# EAGLE design Wii (EAGLE 6.2)
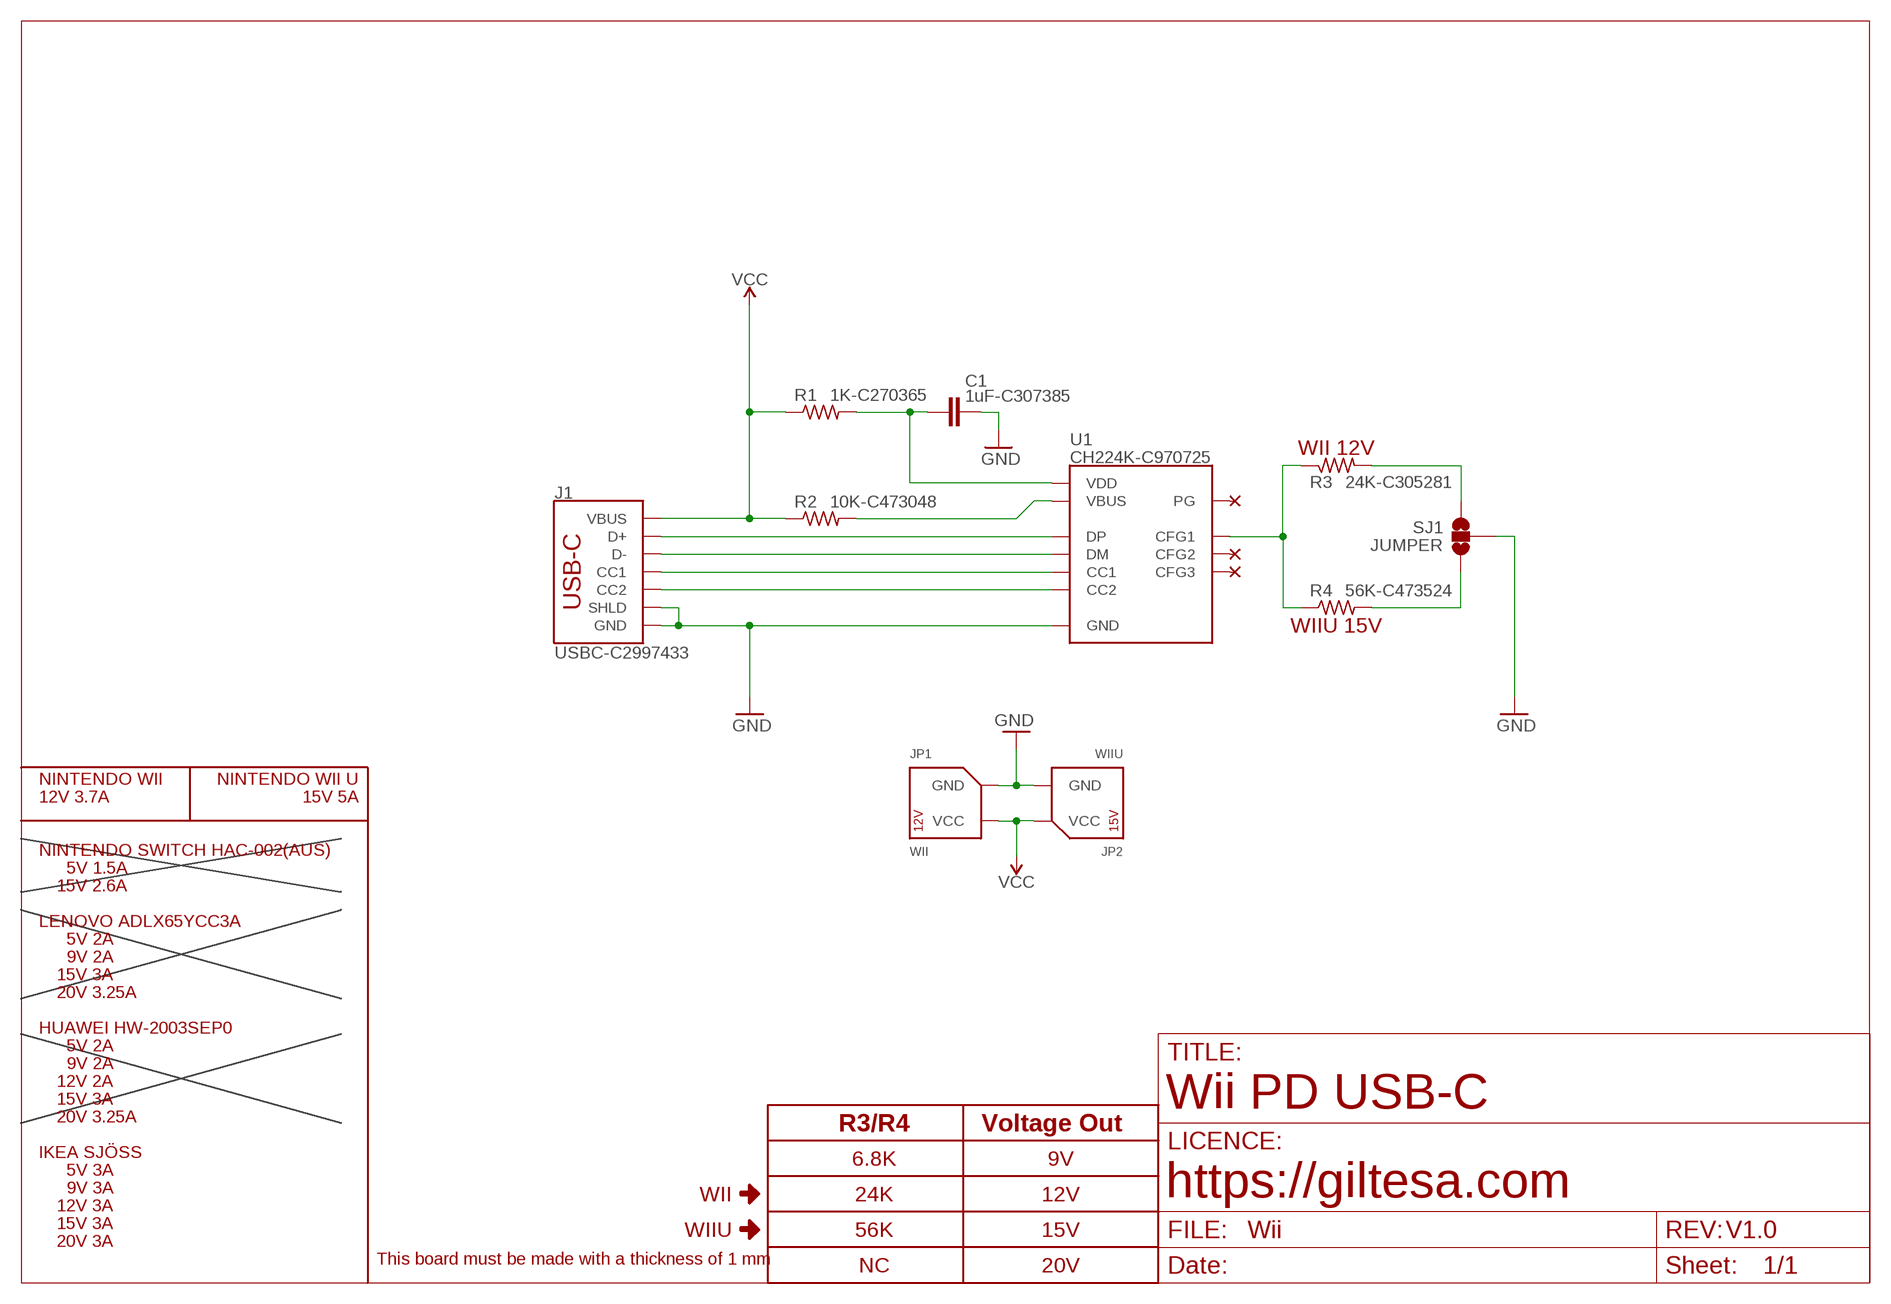
[diagram p0: schematic, sheet 1]

## Parts
C1  1uF-C307385  C0201  [C0201]
J1  USBC-C2997433  USB-C_16P_DATA  [USB-C_16P]
JP1  WII  WII_PWD_CONNECTOR  [WII_1X02]
JP2  WIIU  WII_U_PWD_CONNECTOR  [WIIU_1X02]
R1  1K-C270365  R0201  [R0201]
R2  10K-C473048  R0201  [R0201]
R3  24K-C305281  R0201  [R0201]
R4  56K-C473524  R0201  [R0201]
SJ1  JUMPER  JUMPER-SMD-3_NO  [JUMPER-SMD-3_NO_SILK]
U1  CH224K-C970725  CH224K  [ESSOP10]

## Nets
CC1: J1.A5-CC1(CC1) U1.7(CC1)
CC2: J1.B5-CC2(CC2) U1.6(CC2)
D+: J1.A6-DP1(D+) J1.B6-DP2(D+) U1.4(DP)
D-: J1.A7-DN1(D-) J1.B7-DN2(D-) U1.5(DM)
GND: C1.2 J1.GND1(GND) J1.GND2(GND) J1.SHLD1(SHLD) J1.SHLD2(SHLD) J1.SHLD3(SHLD) J1.SHLD4(SHLD) JP1.GND1(GND) JP2.GND1(GND) SJ1.2 U1.0(GND)
N$1: R3.2 SJ1.1
N$2: R3.1 R4.1 U1.9(CFG1)
N$3: R4.2 SJ1.3
N$6: R2.2 U1.8(VBUS)
VCC: J1.VBUS1(VBUS) J1.VBUS2(VBUS) JP1.VCC1(VCC) JP2.VCC1(VCC) R1.1 R2.1
VDD: C1.1 R1.2 U1.1(VDD)
Unconnected: U1.2(CFG2) U1.3(CFG3) U1.10(PG)

## Notes on the sheet
- WII 12V
- WIIU 15V
- NINTENDO WII | NINTENDO WII U
- 12V 3.7A | 15V 5A
- NINTENDO SWITCH HAC-002(AUS)
- 5V 1.5A
- 15V 2.6A
- LENOVO ADLX65YCC3A
- 5V 2A
- 9V 2A
- 15V 3A
- 20V 3.25A
- HUAWEI HW-2003SEP0
- 5V 2A
- 9V 2A
- 12V 2A
- 15V 3A | Wii PD USB-C
- 20V 3.25A | R3/R4 | Voltage Out
- IKEA SJÖSS | 6.8K | 9V
- 5V 3A
- 9V 3A | WII | 24K | 12V | https://giltesa.com
- 12V 3A
- 15V 3A | WIIU | 56K | 15V
- V1.0
- 20V 3A
- This board must be made with a thickness of 1 mm | NC | 20V

## Library data of the parts
C1 = ,giltesa:C0201
J1 = ,giltesa:USB-C_16P
JP1 = ,giltesa:WII_PWD_CONNECTOR
JP2 = ,giltesa:WII_U_PWD_CONNECTOR
R1-R4 = ,giltesa:R0201
SJ1 = ,giltesa:JUMPER-SMD-3_NO
U1 = ,giltesa:CH224K

## Net classes
1 power: width 0.61 mm, drill 0.406 mm, clearance 0.203 mm
2 gnd: width 0.305 mm, drill 0.406 mm, clearance 0.203 mm
3 power usb: width 0.508 mm, drill 0.406 mm, clearance 0.203 mm

## Board
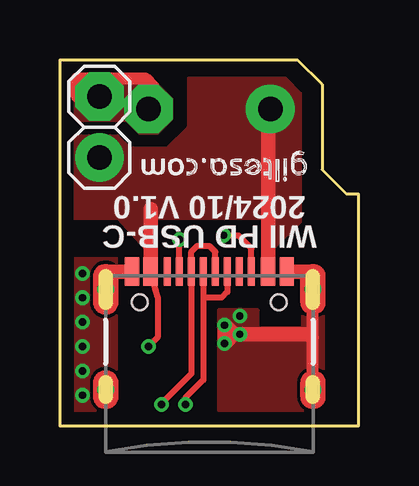
[diagram p1: board, top side]
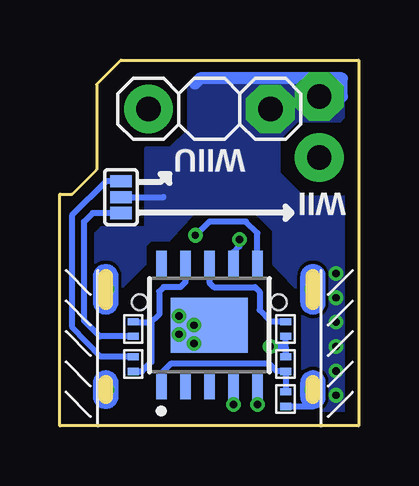
[diagram p2: board, bottom side, seen from below]

Size 12.45 x 15.24 mm. Coordinates in mm from the lower left corner, seen from the top.
Outline: 0,0 12.45,0 12.45,9.65 11.94,9.65 10.92,10.67 10.92,14.22 9.91,15.24 0,15.24 0,0
Copper layers (1*16): Top 0.035mm / dielectric 1.6mm / Bottom 0.035mm
Design rules: minimum track width 6mil, minimum drill 12mil, track to track 6mil, track to pad 6mil, pad to pad 6mil, via to via 8mil, smd to smd 0mil, copper to edge 20mil, drill to drill 10mil, minimum pad ring 6mil, minimum via ring 6mil, stop-mask expansion 0mil, vias tented up to drill 100mil, thermal gap 10mil
tKeepout: 2 lines
bKeepout: 2 lines

### Footprints (pad centres in the part's own frame; a part is rotated, then mirrored left to right if it is on the bottom)
C0201 = smd 0.305 x 0.457: 1 -0.305,0; 2 0.305,0
USB-C_16P = smd 0.3 x 1.2: A5-CC1 -1.25,2.58; A6-DP1 -0.25,2.58; A7-DN1 0.25,2.58; A8-SBU1 1.25,2.58; B5-CC2 1.75,2.58; B6-DP2 0.75,2.58; B7-DN2 -0.75,2.58; B8-SBU2 -1.75,2.58 | smd 0.6 x 1.2: GND1 -3.225,2.58; GND2 3.225,2.58; VBUS1 -2.45,2.58; VBUS2 2.45,2.58 | drill 0.4 pad 0.6: SHLD1 -4.318,1.84; SHLD2 4.318,1.84; SHLD3 -4.318,-2.34; SHLD4 4.318,-2.34 | hole 0.65: -2.89,1.31; 2.89,1.31
WII_1X02 = drill 1.016 pad 2.032 octagon: GND1 1.27,0 | drill 1.016 pad 2.032: VCC1 -1.27,0
WIIU_1X02 = drill 1.016 pad 2.032 octagon: GND1 -2.54,0 | drill 1.016 pad 2.032: VCC1 2.54,0
R0201 = smd 0.305 x 0.457: 1 -0.305,0; 2 0.305,0
JUMPER-SMD-3_NO_SILK = smd 0.508 x 0.889: 1 -0.66,0; 2 0,0; 3 0.66,0
ESSOP10 = smd 3.2 x 2.3: 0 0,0 | smd 0.43 x 1.05: 1 -2,-2.566; 2 -1,-2.566; 3 0,-2.566; 4 1,-2.566; 5 2,-2.566; 6 2,2.566; 7 1,2.566; 8 0,2.566; 9 -1,2.566; 10 -2,2.566

### Placement (x,y rotation side)
C1  3.05,1.11 270 bottom
J1  6.22,3.85 0 top
JP1  1.64,12.45 90 top
JP2  6.22,13.2 180 bottom
R1  3.05,2.57 270 bottom
R2  3.05,4.03 90 bottom
R3  9.4,4.03 270 bottom
R4  9.4,2.57 90 bottom
SJ1  9.91,9.53 90 bottom
U1  6.22,4.19 0 bottom
U$28  [GILTESA.COM_7MM_MASK]  6.85,10.8 180 top

### Tracks (layer width: path | path; a pad name or v marks a point on that pad's centre or on a via)
CC1  (via drill 0.3)
  Top 0.254: J1.A5-CC1 v4.97,7.76
  Bottom 0.254: v4.97,7.76 4.97,7.47 5.21,7.24 5.21,6.77 U1.7
CC2  (via drill 0.3)
  Top 0.254: J1.B5-CC2 7.97,7.39 7.43,7.94 v6.81,7.94
  Bottom 0.254: U1.6 4.22,8.03 4.7,8.51 6.22,8.51 v6.79,7.94 v6.81,7.94
D+  (via drill 0.3)
  Top 0.254: v5.22,0.89 5.22,1.16 5.97,1.91 5.97,5.33 | J1.A6-DP1 5.97,5.33 | J1.B6-DP2 6.97,5.58 6.73,5.33 5.97,5.33
  Bottom 0.254: 5.21,2.02 U1.4 v5.22,0.89
D-  (via drill 0.3)
  Top 0.254: v4.22,0.89 4.22,0.92 5.47,2.17 J1.B7-DN2 5.47,7.25 5.71,7.49 6.22,7.49 6.47,7.24 J1.A7-DN1
  Bottom 0.254: U1.5 v4.22,0.89
GND  (via drill 0.3)
  Top 0.508: 10.54,6.43 J1.SHLD2 10.54,3.68 | 1.91,6.43 J1.SHLD1 | J1.SHLD4 10.54,3.68 | 7.24,3.81 arc-90 v6.86,4.19 | 10.41,3.81 10.54,3.68 | 0.7,13.72 0.7,14.48 3.54,14.48 3.89,14.13
  Top 0.61: J1.GND2 10.54,6.43 | J1.GND1 1.91,6.43 | 7.24,3.81 v6.86,3.43 v6.86,4.19 7.24,3.81 | 7.24,3.81 v7.49,3.81 10.41,3.81
  Bottom 0.254: C1.2 1.91,0.81 J1.SHLD3 | SJ1.2 8.13,9.53
  Bottom 0.508: 6.04,3.43 U1.0 | 0.7,13.72 0.7,14.48 6.6,14.48 6.82,14.26
  Bottom 0.61: U1.0 v6.86,4.19
  other vias: 0.94,1.27 0.94,2.29 0.94,3.3 0.94,4.32 0.94,5.33 0.94,6.35 7.49,4.57
  pour Bottom (no thermals): 2.35,0.64 0.51,0.64 0.51,9.53 2.29,9.53 3.3,10.54 3.3,11.94 2.54,12.7 0.76,12.7 0.38,13.08 0.38,14.35 0.76,14.73 6.6,14.73 7.11,14.22 7.11,12.32 7.87,11.56 8.89,11.56 8.89,8.26 10.73,8.26 10.99,8 10.99,5.21 10.16,4.95 10.16,5.46 8.89,6.73 8.89,7.49 8.64,7.75 7.87,7.75 6.67,9.08 4.51,9.08 3.56,8.13 3.56,6.73 2.35,5.46
  pour Top (no thermals): 2.35,0.64 0.51,0.64 0.51,6.99 2.35,6.99
  pour Top (no thermals): 6.6,4.83 6.6,0.64 10.99,0.64 10.99,6.99 10.1,6.99 10.1,4.06 8.25,4.06 8.25,4.83
  pour Top (no thermals): 0.38,14.35 0.38,13.21 0.86,12.73 2.77,12.73 3.28,12.22 4.09,12.22 4.67,12.8 4.67,13.61 3.68,14.61 0.63,14.61
N$1
  Bottom 0.254: SJ1.1 11.09,8.87 11.44,8.51 11.44,4.38 10.79,3.73 R3.2
N$2
  Bottom 0.254: 7.22,6.37 U1.9 7.22,5.99 7.43,5.78 8.13,5.78 8.32,5.59 8.32,4.64 8.64,4.32 | 8.64,4.32 8.64,2.67 9.04,2.27 R4.1 | R3.1 9.38,4.32 8.64,4.32
N$3
  Bottom 0.254: SJ1.3 10.53,10.19 11.95,8.76 11.95,4.13 10.75,2.88 R4.2
N$6
  Bottom 0.254: R2.2 3.64,4.34 4.13,4.83 4.13,5.59 4.32,5.78 6.03,5.78 6.22,5.97 U1.8
VCC  (via drill 0.3)
  Top 0.254: J1.VBUS1 3.81,6.39 3.81,6.3 4.06,5.36 4.06,3.68 v3.68,3.3
  Top 0.597: J1.VBUS1 3.77,9.02 | J1.VBUS2 8.67,13.12 JP2.VCC1
  Bottom 0.254: R2.1 R1.1 3.05,3.3 v3.68,3.3
  pour Top (no thermals): 0.38,11.68 0.38,8.64 2.41,8.64 3.56,7.37 3.56,8.64 8.89,8.64 8.89,7.37 10.03,8.51 10.03,13.84 9.4,14.48 5.33,14.48 5.33,12.45 4.45,11.56 2.92,11.56 2.41,12.06 0.76,12.06
VDD
  Bottom 0.254: C1.1 R1.2 3.41,2.27 3.75,2.6 7.81,2.6 8.22,2.19 U1.1

### Text on the board
tPlace: 2024/10 V1.0 | WII PD USB-C
bPlace: WIIU | WII